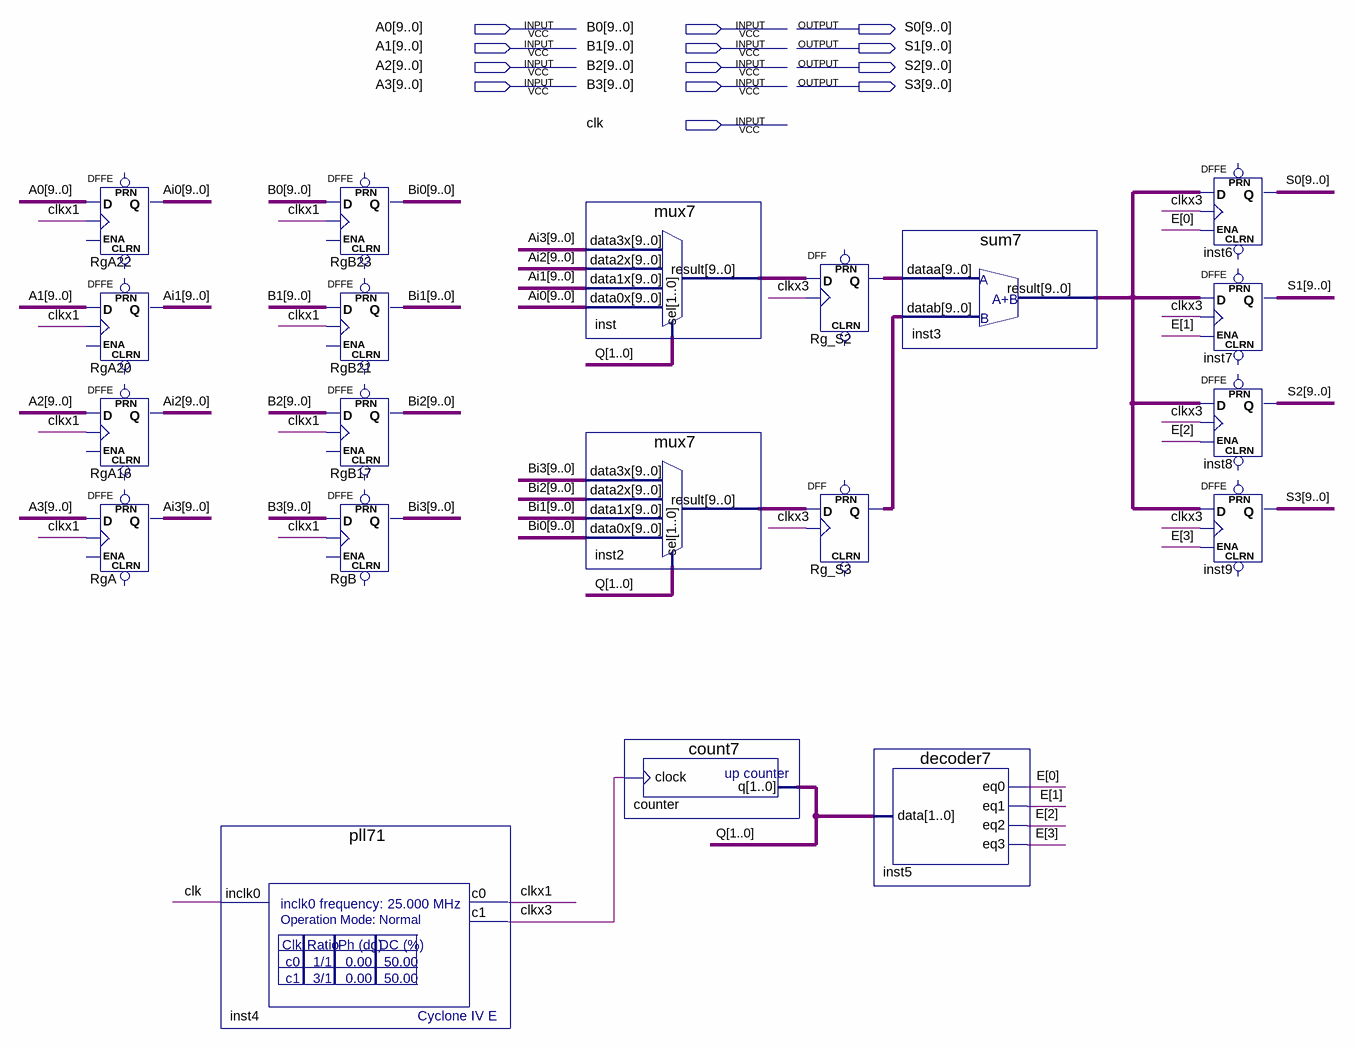
[diagram p0: schematic sheet]
// Quartus schematic b71.bdf as structural Verilog: 20 symbols, 13 pins
module b71 (
  input  [9:0] A0,
  input  [9:0] B0,
  input  [9:0] A1,
  input  [9:0] B1,
  input  [9:0] A2,
  input  [9:0] B2,
  input  [9:0] A3,
  input  [9:0] B3,
  input  clk,
  output [9:0] S0,
  output [9:0] S1,
  output [9:0] S2,
  output [9:0] S3
);

  wire clkx1, clkx3;
  wire [1:0] Q;
  wire [3:0] E;
  wire [9:0] Ai0, Ai1, Ai2, Ai3, Bi0, Bi1, Bi2, Bi3, inst2_result, inst3_result, inst_result, Rg_S2_q,
       Rg_S3_q;

  DFFE RgA22[9:0] (.D(A0), .CLK(clkx1), .Q(Ai0));  // open: PRN, CLRN, ENA
  DFFE RgA20[9:0] (.D(A1), .CLK(clkx1), .Q(Ai1));  // open: PRN, CLRN, ENA
  DFFE RgA16[9:0] (.D(A2), .CLK(clkx1), .Q(Ai2));  // open: PRN, CLRN, ENA
  DFFE RgA[9:0] (.D(A3), .CLK(clkx1), .Q(Ai3));  // open: PRN, CLRN, ENA
  pll71 inst4 (.inclk0(clk), .c0(clkx1), .c1(clkx3));
  DFFE RgB23[9:0] (.D(B0), .CLK(clkx1), .Q(Bi0));  // open: PRN, CLRN, ENA
  DFFE RgB21[9:0] (.D(B1), .CLK(clkx1), .Q(Bi1));  // open: PRN, CLRN, ENA
  DFFE RgB17[9:0] (.D(B2), .CLK(clkx1), .Q(Bi2));  // open: PRN, CLRN, ENA
  DFFE RgB[9:0] (.D(B3), .CLK(clkx1), .Q(Bi3));  // open: PRN, CLRN, ENA
  mux7 inst (.data3x(Ai3), .data2x(Ai2), .data1x(Ai1), .data0x(Ai0), .sel(Q), .result(inst_result));
  mux7 inst2 (.data3x(Bi3), .data2x(Bi2), .data1x(Bi1), .data0x(Bi0), .sel(Q), .result(inst2_result));
  count7 counter (.clock(clkx3), .q(Q));
  DFF Rg_S2[9:0] (.CLK(clkx3), .D(inst_result), .Q(Rg_S2_q));  // open: CLRN, PRN
  DFF Rg_S3[9:0] (.CLK(clkx3), .D(inst2_result), .Q(Rg_S3_q));  // open: CLRN, PRN
  sum7 inst3 (.dataa(Rg_S2_q), .datab(Rg_S3_q), .result(inst3_result));
  decoder7 inst5 (.data(Q), .eq0(E[0]), .eq1(E[1]), .eq2(E[2]), .eq3(E[3]));
  DFFE inst6[9:0] (.D(inst3_result), .CLK(clkx3), .ENA(E[0]), .Q(S0));  // open: PRN, CLRN
  DFFE inst7[9:0] (.D(inst3_result), .CLK(clkx3), .ENA(E[1]), .Q(S1));  // open: PRN, CLRN
  DFFE inst8[9:0] (.D(inst3_result), .CLK(clkx3), .ENA(E[2]), .Q(S2));  // open: PRN, CLRN
  DFFE inst9[9:0] (.D(inst3_result), .CLK(clkx3), .ENA(E[3]), .Q(S3));  // open: PRN, CLRN
endmodule
